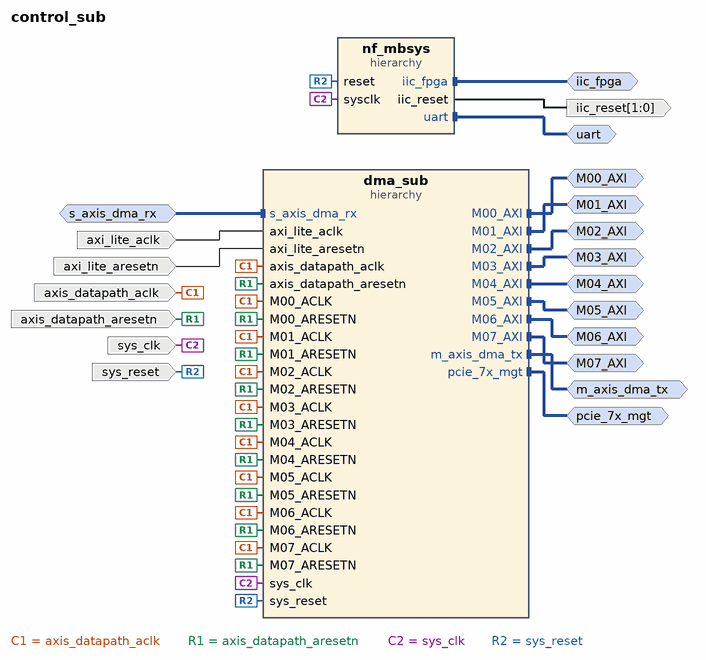
[diagram p0: block diagram of the top level]
# Vivado block design control_sub, xc7vx690tffg1761-3, Vivado 2016.4
create_bd_design control_sub

create_bd_intf_port -mode Master -vlnv xilinx.com:interface:aximm_rtl:1.0 M00_AXI
set_property -dict {CONFIG.DATA_WIDTH 32 CONFIG.PROTOCOL AXI4LITE CONFIG.ADDR_WIDTH 12} [get_bd_intf_ports M00_AXI]
create_bd_intf_port -mode Master -vlnv xilinx.com:interface:aximm_rtl:1.0 M01_AXI
set_property -dict {CONFIG.DATA_WIDTH 32 CONFIG.PROTOCOL AXI4LITE CONFIG.ADDR_WIDTH 12} [get_bd_intf_ports M01_AXI]
create_bd_intf_port -mode Master -vlnv xilinx.com:interface:aximm_rtl:1.0 M02_AXI
set_property -dict {CONFIG.DATA_WIDTH 32 CONFIG.PROTOCOL AXI4LITE CONFIG.ADDR_WIDTH 12} [get_bd_intf_ports M02_AXI]
create_bd_intf_port -mode Master -vlnv xilinx.com:interface:aximm_rtl:1.0 M03_AXI
set_property -dict {CONFIG.DATA_WIDTH 32 CONFIG.PROTOCOL AXI4LITE CONFIG.ADDR_WIDTH 12} [get_bd_intf_ports M03_AXI]
create_bd_intf_port -mode Master -vlnv xilinx.com:interface:aximm_rtl:1.0 M04_AXI
set_property -dict {CONFIG.DATA_WIDTH 32 CONFIG.PROTOCOL AXI4LITE CONFIG.ADDR_WIDTH 12} [get_bd_intf_ports M04_AXI]
create_bd_intf_port -mode Master -vlnv xilinx.com:interface:aximm_rtl:1.0 M05_AXI
set_property -dict {CONFIG.DATA_WIDTH 32 CONFIG.PROTOCOL AXI4LITE CONFIG.ADDR_WIDTH 12} [get_bd_intf_ports M05_AXI]
create_bd_intf_port -mode Master -vlnv xilinx.com:interface:aximm_rtl:1.0 M06_AXI
set_property -dict {CONFIG.DATA_WIDTH 32 CONFIG.PROTOCOL AXI4LITE CONFIG.ADDR_WIDTH 12} [get_bd_intf_ports M06_AXI]
create_bd_intf_port -mode Master -vlnv xilinx.com:interface:aximm_rtl:1.0 M07_AXI
set_property -dict {CONFIG.DATA_WIDTH 32 CONFIG.PROTOCOL AXI4LITE CONFIG.ADDR_WIDTH 12} [get_bd_intf_ports M07_AXI]
create_bd_intf_port -mode Master -vlnv xilinx.com:interface:iic_rtl:1.0 iic_fpga
create_bd_intf_port -mode Master -vlnv xilinx.com:interface:axis_rtl:1.0 m_axis_dma_tx
create_bd_intf_port -mode Master -vlnv xilinx.com:interface:pcie_7x_mgt_rtl:1.0 pcie_7x_mgt
create_bd_intf_port -mode Slave -vlnv xilinx.com:interface:axis_rtl:1.0 s_axis_dma_rx
set_property -dict [list \
  CONFIG.TDATA_NUM_BYTES 32 \
  CONFIG.TDEST_WIDTH 0 \
  CONFIG.TID_WIDTH 0 \
  CONFIG.TUSER_WIDTH 128 \
  CONFIG.HAS_TREADY 1 \
  CONFIG.HAS_TSTRB 0 \
  CONFIG.HAS_TKEEP 1 \
  CONFIG.HAS_TLAST 1 \
  CONFIG.FREQ_HZ 100000000 \
  CONFIG.PHASE 0.000 \
  CONFIG.LAYERED_METADATA undef \
] [get_bd_intf_ports s_axis_dma_rx]
create_bd_intf_port -mode Master -vlnv xilinx.com:interface:uart_rtl:1.0 uart
create_bd_port -dir I -type clk axi_lite_aclk
create_bd_port -dir I -type rst axi_lite_aresetn
set_property -dict {CONFIG.POLARITY ACTIVE_LOW} [get_bd_ports axi_lite_aresetn]
create_bd_port -dir I -type clk axis_datapath_aclk
create_bd_port -dir I -type rst axis_datapath_aresetn
set_property -dict {CONFIG.POLARITY ACTIVE_LOW} [get_bd_ports axis_datapath_aresetn]
create_bd_port -dir O -from 1 -to 0 iic_reset
create_bd_port -dir I -type clk sys_clk
set_property -dict {CONFIG.FREQ_HZ 100000000} [get_bd_ports sys_clk]
create_bd_port -dir I -type rst sys_reset
set_property -dict {CONFIG.POLARITY ACTIVE_HIGH} [get_bd_ports sys_reset]

create_bd_cell -type hier dma_sub
create_bd_cell -type hier nf_mbsys

# ---- hierarchy /dma_sub ----
current_bd_instance /dma_sub
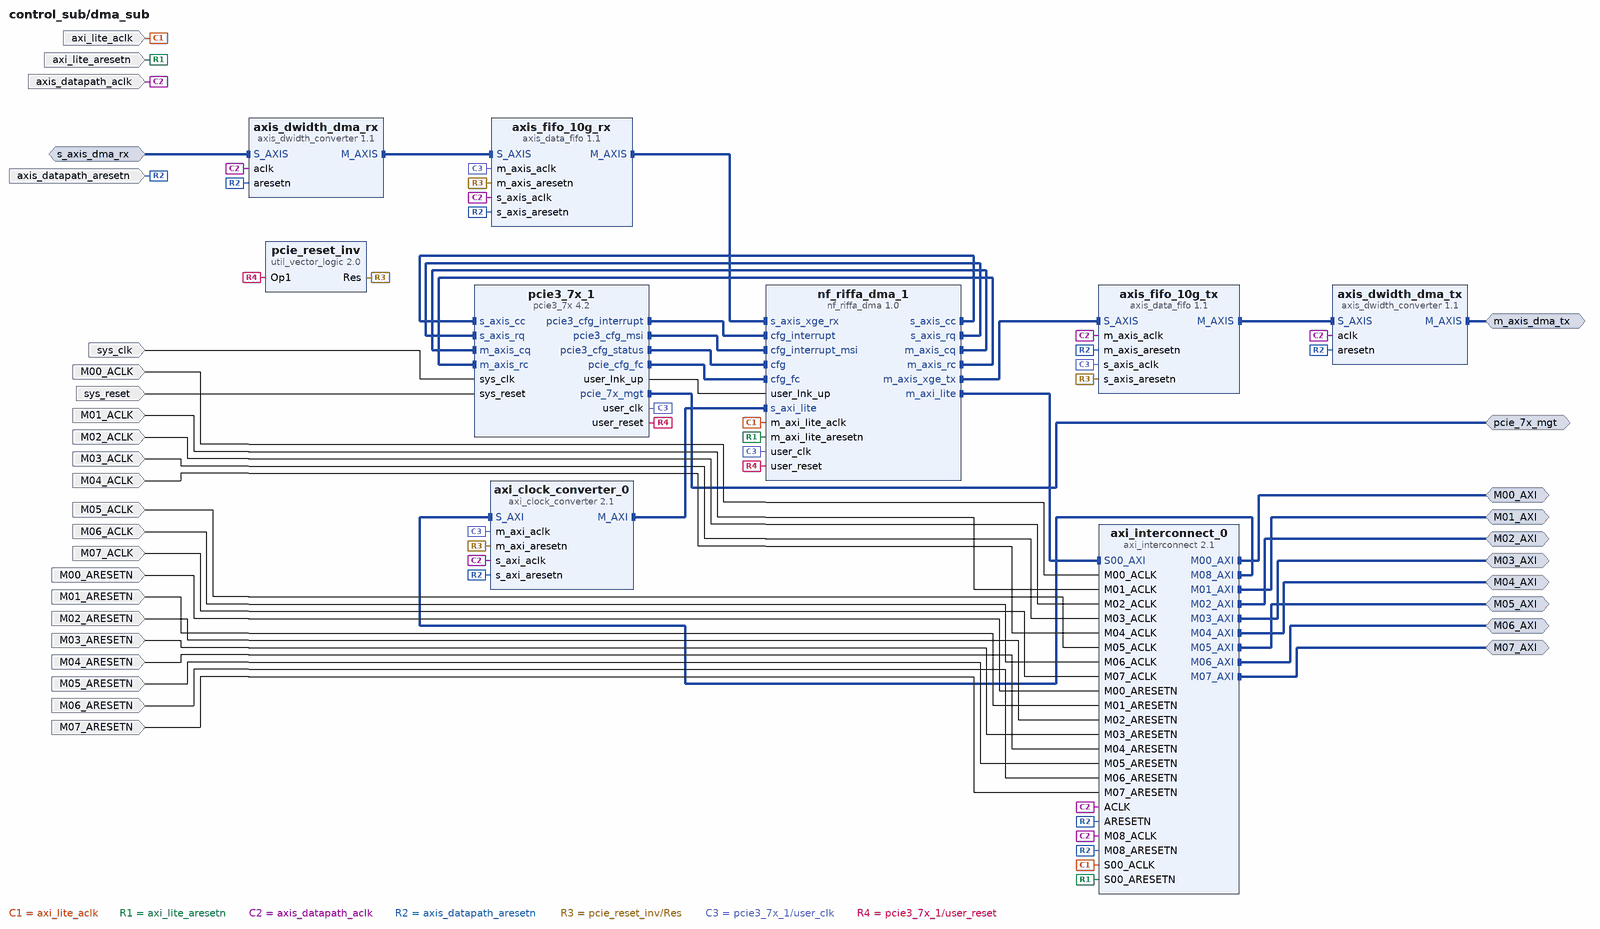
[diagram p1: block diagram inside /dma_sub]
create_bd_intf_pin -mode Master -vlnv xilinx.com:interface:aximm_rtl:1.0 M00_AXI
create_bd_intf_pin -mode Master -vlnv xilinx.com:interface:aximm_rtl:1.0 M01_AXI
create_bd_intf_pin -mode Master -vlnv xilinx.com:interface:aximm_rtl:1.0 M02_AXI
create_bd_intf_pin -mode Master -vlnv xilinx.com:interface:aximm_rtl:1.0 M03_AXI
create_bd_intf_pin -mode Master -vlnv xilinx.com:interface:aximm_rtl:1.0 M04_AXI
create_bd_intf_pin -mode Master -vlnv xilinx.com:interface:aximm_rtl:1.0 M05_AXI
create_bd_intf_pin -mode Master -vlnv xilinx.com:interface:aximm_rtl:1.0 M06_AXI
create_bd_intf_pin -mode Master -vlnv xilinx.com:interface:aximm_rtl:1.0 M07_AXI
create_bd_intf_pin -mode Master -vlnv xilinx.com:interface:axis_rtl:1.0 m_axis_dma_tx
create_bd_intf_pin -mode Master -vlnv xilinx.com:interface:pcie_7x_mgt_rtl:1.0 pcie_7x_mgt
create_bd_intf_pin -mode Slave -vlnv xilinx.com:interface:axis_rtl:1.0 s_axis_dma_rx
create_bd_pin -dir I -type clk axi_lite_aclk
create_bd_pin -dir I -type rst axi_lite_aresetn
create_bd_pin -dir I -type clk axis_datapath_aclk
create_bd_pin -dir I -type rst axis_datapath_aresetn
create_bd_pin -dir I -type clk sys_clk
create_bd_pin -dir I -type rst sys_reset
create_bd_pin -dir I -type clk M00_ACLK
create_bd_pin -dir I -type rst M00_ARESETN
create_bd_pin -dir I -type clk M01_ACLK
create_bd_pin -dir I -type rst M01_ARESETN
create_bd_pin -dir I -type clk M02_ACLK
create_bd_pin -dir I -type rst M02_ARESETN
create_bd_pin -dir I -type clk M03_ACLK
create_bd_pin -dir I -type rst M03_ARESETN
create_bd_pin -dir I -type clk M04_ACLK
create_bd_pin -dir I -type rst M04_ARESETN
create_bd_pin -dir I -type clk M05_ACLK
create_bd_pin -dir I -type rst M05_ARESETN
create_bd_pin -dir I -type clk M06_ACLK
create_bd_pin -dir I -type rst M06_ARESETN
create_bd_pin -dir I -type clk M07_ACLK
create_bd_pin -dir I -type rst M07_ARESETN

create_bd_cell -type ip -vlnv xilinx.com:ip:axi_interconnect:2.1 axi_interconnect_0
set_property -dict [list \
  CONFIG.NUM_MI 9 \
  CONFIG.M00_HAS_REGSLICE 3 \
  CONFIG.M01_HAS_REGSLICE 3 \
  CONFIG.M02_HAS_REGSLICE 3 \
  CONFIG.M03_HAS_REGSLICE 3 \
  CONFIG.M04_HAS_REGSLICE 3 \
  CONFIG.M05_HAS_REGSLICE 3 \
  CONFIG.M06_HAS_REGSLICE 3 \
  CONFIG.M07_HAS_REGSLICE 3 \
  CONFIG.M08_HAS_REGSLICE 3 \
  CONFIG.M00_HAS_DATA_FIFO 1 \
  CONFIG.M01_HAS_DATA_FIFO 1 \
  CONFIG.M02_HAS_DATA_FIFO 1 \
  CONFIG.M03_HAS_DATA_FIFO 1 \
  CONFIG.M04_HAS_DATA_FIFO 1 \
  CONFIG.M05_HAS_DATA_FIFO 1 \
  CONFIG.M06_HAS_DATA_FIFO 1 \
  CONFIG.M07_HAS_DATA_FIFO 1 \
  CONFIG.M08_HAS_DATA_FIFO 1 \
  CONFIG.S00_HAS_REGSLICE 3 \
  CONFIG.S00_HAS_DATA_FIFO 1 \
] [get_bd_cells axi_interconnect_0]
create_bd_cell -type ip -vlnv xilinx.com:ip:util_vector_logic:2.0 pcie_reset_inv
set_property -dict {CONFIG.C_SIZE 1 CONFIG.C_OPERATION not} [get_bd_cells pcie_reset_inv]
create_bd_cell -type ip -vlnv xilinx.com:ip:axis_dwidth_converter:1.1 axis_dwidth_dma_tx
set_property -dict [list \
  CONFIG.S_TDATA_NUM_BYTES 16 \
  CONFIG.M_TDATA_NUM_BYTES 32 \
  CONFIG.TUSER_BITS_PER_BYTE 8 \
  CONFIG.HAS_TLAST 1 \
  CONFIG.HAS_TSTRB 0 \
  CONFIG.HAS_TKEEP 1 \
  CONFIG.HAS_MI_TKEEP 1 \
] [get_bd_cells axis_dwidth_dma_tx]
create_bd_cell -type ip -vlnv xilinx.com:ip:axis_dwidth_converter:1.1 axis_dwidth_dma_rx
set_property -dict [list \
  CONFIG.S_TDATA_NUM_BYTES 32 \
  CONFIG.M_TDATA_NUM_BYTES 16 \
  CONFIG.TUSER_BITS_PER_BYTE 8 \
  CONFIG.HAS_TLAST 1 \
  CONFIG.HAS_TSTRB 0 \
  CONFIG.HAS_TKEEP 1 \
  CONFIG.HAS_MI_TKEEP 1 \
] [get_bd_cells axis_dwidth_dma_rx]
create_bd_cell -type ip -vlnv xilinx.com:ip:axis_data_fifo:1.1 axis_fifo_10g_rx
set_property -dict [list \
  CONFIG.TDATA_NUM_BYTES 16 \
  CONFIG.TUSER_WIDTH 128 \
  CONFIG.FIFO_DEPTH 32 \
  CONFIG.IS_ACLK_ASYNC 1 \
] [get_bd_cells axis_fifo_10g_rx]
create_bd_cell -type ip -vlnv xilinx.com:ip:axis_data_fifo:1.1 axis_fifo_10g_tx
set_property -dict [list \
  CONFIG.TDATA_NUM_BYTES 16 \
  CONFIG.TUSER_WIDTH 128 \
  CONFIG.FIFO_DEPTH 32 \
  CONFIG.IS_ACLK_ASYNC 1 \
] [get_bd_cells axis_fifo_10g_tx]
create_bd_cell -type ip -vlnv NetFPGA:NetFPGA:nf_riffa_dma:1.0 nf_riffa_dma_1
create_bd_cell -type ip -vlnv xilinx.com:ip:axi_clock_converter:2.1 axi_clock_converter_0
create_bd_cell -type ip -vlnv xilinx.com:ip:pcie3_7x:4.2 pcie3_7x_1
set_property -dict [list \
  CONFIG.xlnx_ref_board None \
  CONFIG.PL_LINK_CAP_MAX_LINK_SPEED 5.0_GT/s \
  CONFIG.PL_LINK_CAP_MAX_LINK_WIDTH X8 \
  CONFIG.axisten_if_enable_client_tag false \
  CONFIG.PF0_DEVICE_ID 7028 \
  CONFIG.PF0_INTERRUPT_PIN NONE \
  CONFIG.PF1_DEVICE_ID 7011 \
  CONFIG.pcie_blk_locn X0Y1 \
  CONFIG.pf0_bar0_size 1 \
  CONFIG.pf0_dev_cap_max_payload 128_bytes \
  CONFIG.gen_x0y0 false \
  CONFIG.extended_tag_field true \
  CONFIG.axisten_if_width 128_bit \
  CONFIG.mode_selection Advanced \
  CONFIG.en_ext_clk false \
  CONFIG.tx_fc_if false \
  CONFIG.cfg_ext_if false \
  CONFIG.per_func_status_if false \
  CONFIG.cfg_mgmt_if false \
  CONFIG.rcv_msg_if false \
  CONFIG.cfg_tx_msg_if false \
  CONFIG.cfg_ctl_if false \
  CONFIG.axisten_freq 250 \
] [get_bd_cells pcie3_7x_1]

# ---- hierarchy /nf_mbsys ----
current_bd_instance /nf_mbsys
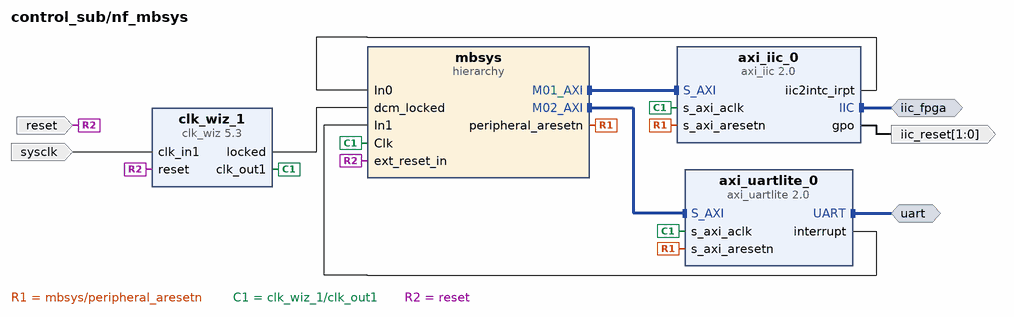
[diagram p2: block diagram inside /nf_mbsys]
create_bd_intf_pin -mode Master -vlnv xilinx.com:interface:iic_rtl:1.0 iic_fpga
create_bd_intf_pin -mode Master -vlnv xilinx.com:interface:uart_rtl:1.0 uart
create_bd_pin -dir O -from 1 -to 0 iic_reset
create_bd_pin -dir I -type rst reset
create_bd_pin -dir I -type clk sysclk

create_bd_cell -type ip -vlnv xilinx.com:ip:axi_iic:2.0 axi_iic_0
set_property -dict {CONFIG.C_GPO_WIDTH 2 CONFIG.C_SCL_INERTIAL_DELAY 5 CONFIG.C_SDA_INERTIAL_DELAY 5} [get_bd_cells axi_iic_0]
create_bd_cell -type ip -vlnv xilinx.com:ip:axi_uartlite:2.0 axi_uartlite_0
set_property -dict {CONFIG.C_BAUDRATE 115200} [get_bd_cells axi_uartlite_0]
create_bd_cell -type ip -vlnv xilinx.com:ip:clk_wiz:5.3 clk_wiz_1
set_property -dict [list \
  CONFIG.PRIM_IN_FREQ 100.000 \
  CONFIG.CLKIN1_JITTER_PS 100.0 \
  CONFIG.PRIM_SOURCE No_buffer \
  CONFIG.MMCM_CLKFBOUT_MULT_F 10.000 \
  CONFIG.MMCM_CLKIN1_PERIOD 10.0 \
  CONFIG.CLKOUT1_JITTER 130.958 \
  CONFIG.CLKOUT1_PHASE_ERROR 98.575 \
] [get_bd_cells clk_wiz_1]
create_bd_cell -type hier mbsys

# ---- hierarchy /nf_mbsys/mbsys ----
current_bd_instance /nf_mbsys/mbsys
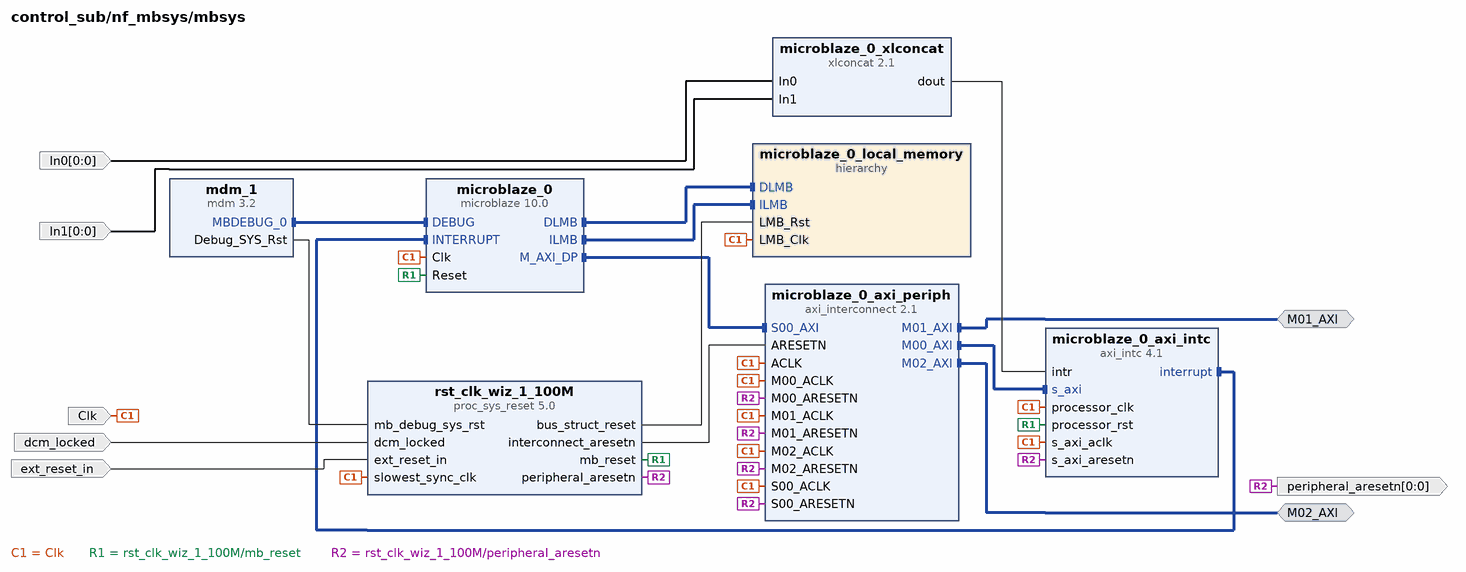
[diagram p3: block diagram inside /nf_mbsys/mbsys]
create_bd_intf_pin -mode Master -vlnv xilinx.com:interface:aximm_rtl:1.0 M01_AXI
create_bd_intf_pin -mode Master -vlnv xilinx.com:interface:aximm_rtl:1.0 M02_AXI
create_bd_pin -dir I -type clk Clk
create_bd_pin -dir I -from 0 -to 0 In0
create_bd_pin -dir I -from 0 -to 0 In1
create_bd_pin -dir I dcm_locked
create_bd_pin -dir I -type rst ext_reset_in
create_bd_pin -dir O -from 0 -to 0 -type rst peripheral_aresetn

create_bd_cell -type ip -vlnv xilinx.com:ip:mdm:3.2 mdm_1
create_bd_cell -type ip -vlnv xilinx.com:ip:microblaze:10.0 microblaze_0
set_property -dict {CONFIG.C_D_AXI 1 CONFIG.C_D_LMB 1 CONFIG.C_I_LMB 1 CONFIG.C_DEBUG_ENABLED 1} [get_bd_cells microblaze_0]
create_bd_cell -type ip -vlnv xilinx.com:ip:axi_intc:4.1 microblaze_0_axi_intc
set_property -dict {CONFIG.C_HAS_FAST 1} [get_bd_cells microblaze_0_axi_intc]
create_bd_cell -type ip -vlnv xilinx.com:ip:axi_interconnect:2.1 microblaze_0_axi_periph
set_property -dict {CONFIG.NUM_MI 3} [get_bd_cells microblaze_0_axi_periph]
create_bd_cell -type hier microblaze_0_local_memory
create_bd_cell -type ip -vlnv xilinx.com:ip:xlconcat:2.1 microblaze_0_xlconcat
create_bd_cell -type ip -vlnv xilinx.com:ip:proc_sys_reset:5.0 rst_clk_wiz_1_100M

# ---- hierarchy /nf_mbsys/mbsys/microblaze_0_local_memory ----
current_bd_instance /nf_mbsys/mbsys/microblaze_0_local_memory
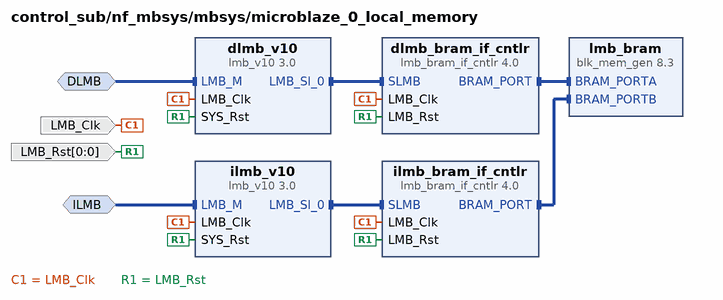
[diagram p4: block diagram inside /nf_mbsys/mbsys/microblaze_0_local_memory]
create_bd_intf_pin -mode MirroredMaster -vlnv xilinx.com:interface:lmb_rtl:1.0 DLMB
create_bd_intf_pin -mode MirroredMaster -vlnv xilinx.com:interface:lmb_rtl:1.0 ILMB
create_bd_pin -dir I -type clk LMB_Clk
create_bd_pin -dir I -from 0 -to 0 -type rst LMB_Rst

create_bd_cell -type ip -vlnv xilinx.com:ip:lmb_bram_if_cntlr:4.0 dlmb_bram_if_cntlr
set_property -dict {CONFIG.C_ECC 0} [get_bd_cells dlmb_bram_if_cntlr]
create_bd_cell -type ip -vlnv xilinx.com:ip:lmb_v10:3.0 dlmb_v10
create_bd_cell -type ip -vlnv xilinx.com:ip:lmb_bram_if_cntlr:4.0 ilmb_bram_if_cntlr
set_property -dict {CONFIG.C_ECC 0} [get_bd_cells ilmb_bram_if_cntlr]
create_bd_cell -type ip -vlnv xilinx.com:ip:lmb_v10:3.0 ilmb_v10
create_bd_cell -type ip -vlnv xilinx.com:ip:blk_mem_gen:8.3 lmb_bram
set_property -dict {CONFIG.Memory_Type True_Dual_Port_RAM CONFIG.use_bram_block BRAM_Controller} [get_bd_cells lmb_bram]

# ---- connections ----

current_bd_instance /dma_sub
connect_bd_intf_net -intf_net nf_riffa_dma_1_fifo_dwidth_rx [get_bd_intf_pins axis_fifo_10g_rx/S_AXIS] [get_bd_intf_pins axis_dwidth_dma_rx/M_AXIS]
connect_bd_intf_net [get_bd_intf_pins axis_fifo_10g_rx/M_AXIS] [get_bd_intf_pins nf_riffa_dma_1/s_axis_xge_rx]
connect_bd_intf_net -intf_net nf_riffa_dma_1_fifo_dwidth_tx [get_bd_intf_pins axis_fifo_10g_tx/M_AXIS] [get_bd_intf_pins axis_dwidth_dma_tx/S_AXIS]
connect_bd_intf_net -intf_net nf_riffa_dma_1_dwidth_conv_tx [get_bd_intf_pins axis_fifo_10g_tx/S_AXIS] [get_bd_intf_pins nf_riffa_dma_1/m_axis_xge_tx]
connect_bd_intf_net -intf_net nf_riffa_dma_1_pcie3_cfg_interrupt [get_bd_intf_pins nf_riffa_dma_1/cfg_interrupt] [get_bd_intf_pins pcie3_7x_1/pcie3_cfg_interrupt]
connect_bd_intf_net -intf_net nf_riffa_dma_1_pcie3_cfg_msi [get_bd_intf_pins nf_riffa_dma_1/cfg_interrupt_msi] [get_bd_intf_pins pcie3_7x_1/pcie3_cfg_msi]
connect_bd_intf_net -intf_net nf_riffa_dma_1_pcie3_cfg_status [get_bd_intf_pins nf_riffa_dma_1/cfg] [get_bd_intf_pins pcie3_7x_1/pcie3_cfg_status]
connect_bd_intf_net -intf_net nf_riffa_dma_1_pcie_cfg_fc [get_bd_intf_pins nf_riffa_dma_1/cfg_fc] [get_bd_intf_pins pcie3_7x_1/pcie_cfg_fc]
connect_bd_intf_net [get_bd_intf_pins nf_riffa_dma_1/s_axis_cc] [get_bd_intf_pins pcie3_7x_1/s_axis_cc]
connect_bd_intf_net [get_bd_intf_pins nf_riffa_dma_1/s_axis_rq] [get_bd_intf_pins pcie3_7x_1/s_axis_rq]
connect_bd_intf_net [get_bd_intf_pins nf_riffa_dma_1/m_axis_cq] [get_bd_intf_pins pcie3_7x_1/m_axis_cq]
connect_bd_intf_net [get_bd_intf_pins nf_riffa_dma_1/m_axis_rc] [get_bd_intf_pins pcie3_7x_1/m_axis_rc]
connect_bd_intf_net [get_bd_intf_pins axi_interconnect_0/S00_AXI] [get_bd_intf_pins nf_riffa_dma_1/m_axi_lite]
connect_bd_intf_net [get_bd_intf_pins axi_clock_converter_0/M_AXI] [get_bd_intf_pins nf_riffa_dma_1/s_axi_lite]
connect_bd_intf_net [get_bd_intf_pins axi_clock_converter_0/S_AXI] [get_bd_intf_pins axi_interconnect_0/M08_AXI]
connect_bd_intf_net [get_bd_intf_pins M00_AXI] [get_bd_intf_pins axi_interconnect_0/M00_AXI]
connect_bd_intf_net [get_bd_intf_pins M01_AXI] [get_bd_intf_pins axi_interconnect_0/M01_AXI]
connect_bd_intf_net [get_bd_intf_pins M02_AXI] [get_bd_intf_pins axi_interconnect_0/M02_AXI]
connect_bd_intf_net [get_bd_intf_pins M03_AXI] [get_bd_intf_pins axi_interconnect_0/M03_AXI]
connect_bd_intf_net [get_bd_intf_pins M04_AXI] [get_bd_intf_pins axi_interconnect_0/M04_AXI]
connect_bd_intf_net [get_bd_intf_pins M05_AXI] [get_bd_intf_pins axi_interconnect_0/M05_AXI]
connect_bd_intf_net [get_bd_intf_pins M06_AXI] [get_bd_intf_pins axi_interconnect_0/M06_AXI]
connect_bd_intf_net [get_bd_intf_pins M07_AXI] [get_bd_intf_pins axi_interconnect_0/M07_AXI]
connect_bd_intf_net -intf_net nf_riffa_dma_1_m_axis_dma_tx [get_bd_intf_pins m_axis_dma_tx] [get_bd_intf_pins axis_dwidth_dma_tx/M_AXIS]
connect_bd_intf_net [get_bd_intf_pins pcie_7x_mgt] [get_bd_intf_pins pcie3_7x_1/pcie_7x_mgt]
connect_bd_intf_net -intf_net nf_riffa_dma_1_s_axis_dma_rx [get_bd_intf_pins s_axis_dma_rx] [get_bd_intf_pins axis_dwidth_dma_rx/S_AXIS]
connect_bd_net -net axi_lite_clk_1 [get_bd_pins axi_lite_aclk] [get_bd_pins axi_interconnect_0/S00_ACLK] [get_bd_pins nf_riffa_dma_1/m_axi_lite_aclk]
connect_bd_net -net M00_ACLK_i [get_bd_pins M00_ACLK] [get_bd_pins axi_interconnect_0/M00_ACLK]
connect_bd_net -net M01_ACLK_i [get_bd_pins M01_ACLK] [get_bd_pins axi_interconnect_0/M01_ACLK]
connect_bd_net -net M02_ACLK_i [get_bd_pins M02_ACLK] [get_bd_pins axi_interconnect_0/M02_ACLK]
connect_bd_net -net M03_ACLK_i [get_bd_pins M03_ACLK] [get_bd_pins axi_interconnect_0/M03_ACLK]
connect_bd_net -net M04_ACLK_i [get_bd_pins M04_ACLK] [get_bd_pins axi_interconnect_0/M04_ACLK]
connect_bd_net -net M05_ACLK_i [get_bd_pins M05_ACLK] [get_bd_pins axi_interconnect_0/M05_ACLK]
connect_bd_net -net M06_ACLK_i [get_bd_pins M06_ACLK] [get_bd_pins axi_interconnect_0/M06_ACLK]
connect_bd_net -net M07_ACLK_i [get_bd_pins M07_ACLK] [get_bd_pins axi_interconnect_0/M07_ACLK]
connect_bd_net -net axi_lite_rstn_1 [get_bd_pins axi_lite_aresetn] \
  [get_bd_pins axi_interconnect_0/S00_ARESETN] [get_bd_pins nf_riffa_dma_1/m_axi_lite_aresetn]
connect_bd_net -net M00_ARESETN_i [get_bd_pins M00_ARESETN] [get_bd_pins axi_interconnect_0/M00_ARESETN]
connect_bd_net -net M01_ARESETN_i [get_bd_pins M01_ARESETN] [get_bd_pins axi_interconnect_0/M01_ARESETN]
connect_bd_net -net M02_ARESETN_i [get_bd_pins M02_ARESETN] [get_bd_pins axi_interconnect_0/M02_ARESETN]
connect_bd_net -net M03_ARESETN_i [get_bd_pins M03_ARESETN] [get_bd_pins axi_interconnect_0/M03_ARESETN]
connect_bd_net -net M04_ARESETN_i [get_bd_pins M04_ARESETN] [get_bd_pins axi_interconnect_0/M04_ARESETN]
connect_bd_net -net M05_ARESETN_i [get_bd_pins M05_ARESETN] [get_bd_pins axi_interconnect_0/M05_ARESETN]
connect_bd_net -net M06_ARESETN_i [get_bd_pins M06_ARESETN] [get_bd_pins axi_interconnect_0/M06_ARESETN]
connect_bd_net -net M07_ARESETN_i [get_bd_pins M07_ARESETN] [get_bd_pins axi_interconnect_0/M07_ARESETN]
connect_bd_net -net axis_10g_clk_1 [get_bd_pins axis_datapath_aclk] \
  [get_bd_pins axi_clock_converter_0/s_axi_aclk] [get_bd_pins axi_interconnect_0/ACLK] \
  [get_bd_pins axi_interconnect_0/M08_ACLK] [get_bd_pins axis_dwidth_dma_rx/aclk] [get_bd_pins axis_dwidth_dma_tx/aclk] \
  [get_bd_pins axis_fifo_10g_rx/s_axis_aclk] [get_bd_pins axis_fifo_10g_tx/m_axis_aclk]
connect_bd_net -net axis_rx_sys_reset_0_peripheral_aresetn [get_bd_pins axis_datapath_aresetn] \
  [get_bd_pins axi_clock_converter_0/s_axi_aresetn] [get_bd_pins axi_interconnect_0/ARESETN] \
  [get_bd_pins axi_interconnect_0/M08_ARESETN] [get_bd_pins axis_dwidth_dma_rx/aresetn] \
  [get_bd_pins axis_dwidth_dma_tx/aresetn] [get_bd_pins axis_fifo_10g_rx/s_axis_aresetn] \
  [get_bd_pins axis_fifo_10g_tx/m_axis_aresetn]
connect_bd_net -net axis_tx_sys_reset_0_peripheral_aresetn [get_bd_pins pcie_reset_inv/Res] \
  [get_bd_pins axi_clock_converter_0/m_axi_aresetn] [get_bd_pins axis_fifo_10g_rx/m_axis_aresetn] \
  [get_bd_pins axis_fifo_10g_tx/s_axis_aresetn]
connect_bd_net [get_bd_pins pcie3_7x_1/user_clk] \
  [get_bd_pins axi_clock_converter_0/m_axi_aclk] [get_bd_pins axis_fifo_10g_rx/m_axis_aclk] \
  [get_bd_pins axis_fifo_10g_tx/s_axis_aclk] [get_bd_pins nf_riffa_dma_1/user_clk]
connect_bd_net [get_bd_pins pcie3_7x_1/user_lnk_up] [get_bd_pins nf_riffa_dma_1/user_lnk_up]
connect_bd_net [get_bd_pins pcie3_7x_1/user_reset] [get_bd_pins pcie_reset_inv/Op1] [get_bd_pins nf_riffa_dma_1/user_reset]
connect_bd_net [get_bd_pins sys_clk] [get_bd_pins pcie3_7x_1/sys_clk]
connect_bd_net [get_bd_pins sys_reset] [get_bd_pins pcie3_7x_1/sys_reset]

current_bd_instance /nf_mbsys
connect_bd_intf_net [get_bd_intf_pins axi_iic_0/S_AXI] [get_bd_intf_pins mbsys/M01_AXI]
connect_bd_intf_net [get_bd_intf_pins axi_uartlite_0/S_AXI] [get_bd_intf_pins mbsys/M02_AXI]
connect_bd_intf_net [get_bd_intf_pins iic_fpga] [get_bd_intf_pins axi_iic_0/IIC]
connect_bd_intf_net [get_bd_intf_pins uart] [get_bd_intf_pins axi_uartlite_0/UART]
connect_bd_net [get_bd_pins axi_iic_0/gpo] [get_bd_pins iic_reset]
connect_bd_net [get_bd_pins axi_iic_0/iic2intc_irpt] [get_bd_pins mbsys/In0]
connect_bd_net [get_bd_pins axi_uartlite_0/interrupt] [get_bd_pins mbsys/In1]
connect_bd_net [get_bd_pins clk_wiz_1/locked] [get_bd_pins mbsys/dcm_locked]
connect_bd_net [get_bd_pins mbsys/peripheral_aresetn] [get_bd_pins axi_iic_0/s_axi_aresetn] [get_bd_pins axi_uartlite_0/s_axi_aresetn]
connect_bd_net -net microblaze_0_Clk [get_bd_pins clk_wiz_1/clk_out1] \
  [get_bd_pins axi_iic_0/s_axi_aclk] [get_bd_pins axi_uartlite_0/s_axi_aclk] [get_bd_pins mbsys/Clk]
connect_bd_net [get_bd_pins reset] [get_bd_pins clk_wiz_1/reset] [get_bd_pins mbsys/ext_reset_in]
connect_bd_net [get_bd_pins sysclk] [get_bd_pins clk_wiz_1/clk_in1]

current_bd_instance /nf_mbsys/mbsys
connect_bd_intf_net -intf_net microblaze_0_axi_dp [get_bd_intf_pins microblaze_0/M_AXI_DP] [get_bd_intf_pins microblaze_0_axi_periph/S00_AXI]
connect_bd_intf_net [get_bd_intf_pins mdm_1/MBDEBUG_0] [get_bd_intf_pins microblaze_0/DEBUG]
connect_bd_intf_net [get_bd_intf_pins microblaze_0/DLMB] [get_bd_intf_pins microblaze_0_local_memory/DLMB]
connect_bd_intf_net [get_bd_intf_pins microblaze_0/ILMB] [get_bd_intf_pins microblaze_0_local_memory/ILMB]
connect_bd_intf_net -intf_net microblaze_0_intc_axi [get_bd_intf_pins microblaze_0_axi_intc/s_axi] [get_bd_intf_pins microblaze_0_axi_periph/M00_AXI]
connect_bd_intf_net [get_bd_intf_pins microblaze_0/INTERRUPT] [get_bd_intf_pins microblaze_0_axi_intc/interrupt]
connect_bd_intf_net [get_bd_intf_pins M01_AXI] [get_bd_intf_pins microblaze_0_axi_periph/M01_AXI]
connect_bd_intf_net [get_bd_intf_pins M02_AXI] [get_bd_intf_pins microblaze_0_axi_periph/M02_AXI]
connect_bd_net -net In0_1 [get_bd_pins In0] [get_bd_pins microblaze_0_xlconcat/In0]
connect_bd_net -net In1_1 [get_bd_pins In1] [get_bd_pins microblaze_0_xlconcat/In1]
connect_bd_net -net clk_wiz_1_locked [get_bd_pins dcm_locked] [get_bd_pins rst_clk_wiz_1_100M/dcm_locked]
connect_bd_net [get_bd_pins mdm_1/Debug_SYS_Rst] [get_bd_pins rst_clk_wiz_1_100M/mb_debug_sys_rst]
connect_bd_net -net microblaze_0_Clk [get_bd_pins Clk] \
  [get_bd_pins microblaze_0/Clk] [get_bd_pins microblaze_0_axi_intc/processor_clk] \
  [get_bd_pins microblaze_0_axi_intc/s_axi_aclk] [get_bd_pins microblaze_0_axi_periph/ACLK] \
  [get_bd_pins microblaze_0_axi_periph/M00_ACLK] [get_bd_pins microblaze_0_axi_periph/M01_ACLK] \
  [get_bd_pins microblaze_0_axi_periph/M02_ACLK] [get_bd_pins microblaze_0_axi_periph/S00_ACLK] \
  [get_bd_pins microblaze_0_local_memory/LMB_Clk] [get_bd_pins rst_clk_wiz_1_100M/slowest_sync_clk]
connect_bd_net -net microblaze_0_intr [get_bd_pins microblaze_0_xlconcat/dout] [get_bd_pins microblaze_0_axi_intc/intr]
connect_bd_net -net reset_1 [get_bd_pins ext_reset_in] [get_bd_pins rst_clk_wiz_1_100M/ext_reset_in]
connect_bd_net [get_bd_pins rst_clk_wiz_1_100M/bus_struct_reset] [get_bd_pins microblaze_0_local_memory/LMB_Rst]
connect_bd_net [get_bd_pins rst_clk_wiz_1_100M/interconnect_aresetn] [get_bd_pins microblaze_0_axi_periph/ARESETN]
connect_bd_net [get_bd_pins rst_clk_wiz_1_100M/mb_reset] [get_bd_pins microblaze_0/Reset] [get_bd_pins microblaze_0_axi_intc/processor_rst]
connect_bd_net [get_bd_pins rst_clk_wiz_1_100M/peripheral_aresetn] \
  [get_bd_pins peripheral_aresetn] [get_bd_pins microblaze_0_axi_intc/s_axi_aresetn] \
  [get_bd_pins microblaze_0_axi_periph/M00_ARESETN] [get_bd_pins microblaze_0_axi_periph/M01_ARESETN] \
  [get_bd_pins microblaze_0_axi_periph/M02_ARESETN] [get_bd_pins microblaze_0_axi_periph/S00_ARESETN]

current_bd_instance /nf_mbsys/mbsys/microblaze_0_local_memory
connect_bd_intf_net -intf_net microblaze_0_dlmb_bus [get_bd_intf_pins dlmb_bram_if_cntlr/SLMB] [get_bd_intf_pins dlmb_v10/LMB_Sl_0]
connect_bd_intf_net -intf_net microblaze_0_dlmb_cntlr [get_bd_intf_pins dlmb_bram_if_cntlr/BRAM_PORT] [get_bd_intf_pins lmb_bram/BRAM_PORTA]
connect_bd_intf_net -intf_net microblaze_0_ilmb_bus [get_bd_intf_pins ilmb_bram_if_cntlr/SLMB] [get_bd_intf_pins ilmb_v10/LMB_Sl_0]
connect_bd_intf_net -intf_net microblaze_0_ilmb_cntlr [get_bd_intf_pins ilmb_bram_if_cntlr/BRAM_PORT] [get_bd_intf_pins lmb_bram/BRAM_PORTB]
connect_bd_intf_net -intf_net microblaze_0_dlmb [get_bd_intf_pins DLMB] [get_bd_intf_pins dlmb_v10/LMB_M]
connect_bd_intf_net -intf_net microblaze_0_ilmb [get_bd_intf_pins ILMB] [get_bd_intf_pins ilmb_v10/LMB_M]
connect_bd_net -net microblaze_0_Clk [get_bd_pins LMB_Clk] \
  [get_bd_pins dlmb_bram_if_cntlr/LMB_Clk] [get_bd_pins dlmb_v10/LMB_Clk] [get_bd_pins ilmb_bram_if_cntlr/LMB_Clk] \
  [get_bd_pins ilmb_v10/LMB_Clk]
connect_bd_net -net microblaze_0_LMB_Rst [get_bd_pins LMB_Rst] \
  [get_bd_pins dlmb_bram_if_cntlr/LMB_Rst] [get_bd_pins dlmb_v10/SYS_Rst] [get_bd_pins ilmb_bram_if_cntlr/LMB_Rst] \
  [get_bd_pins ilmb_v10/SYS_Rst]

current_bd_instance /
connect_bd_intf_net [get_bd_intf_ports M00_AXI] [get_bd_intf_pins dma_sub/M00_AXI]
connect_bd_intf_net [get_bd_intf_ports M01_AXI] [get_bd_intf_pins dma_sub/M01_AXI]
connect_bd_intf_net [get_bd_intf_ports M02_AXI] [get_bd_intf_pins dma_sub/M02_AXI]
connect_bd_intf_net [get_bd_intf_ports M03_AXI] [get_bd_intf_pins dma_sub/M03_AXI]
connect_bd_intf_net [get_bd_intf_ports M04_AXI] [get_bd_intf_pins dma_sub/M04_AXI]
connect_bd_intf_net [get_bd_intf_ports M05_AXI] [get_bd_intf_pins dma_sub/M05_AXI]
connect_bd_intf_net [get_bd_intf_ports M06_AXI] [get_bd_intf_pins dma_sub/M06_AXI]
connect_bd_intf_net [get_bd_intf_ports M07_AXI] [get_bd_intf_pins dma_sub/M07_AXI]
connect_bd_intf_net [get_bd_intf_ports iic_fpga] [get_bd_intf_pins nf_mbsys/iic_fpga]
connect_bd_intf_net [get_bd_intf_ports m_axis_dma_tx] [get_bd_intf_pins dma_sub/m_axis_dma_tx]
connect_bd_intf_net [get_bd_intf_ports pcie_7x_mgt] [get_bd_intf_pins dma_sub/pcie_7x_mgt]
connect_bd_intf_net [get_bd_intf_ports s_axis_dma_rx] [get_bd_intf_pins dma_sub/s_axis_dma_rx]
connect_bd_intf_net [get_bd_intf_ports uart] [get_bd_intf_pins nf_mbsys/uart]
connect_bd_net [get_bd_ports axi_lite_aclk] [get_bd_pins dma_sub/axi_lite_aclk]
connect_bd_net [get_bd_ports axi_lite_aresetn] [get_bd_pins dma_sub/axi_lite_aresetn]
connect_bd_net [get_bd_ports axis_datapath_aclk] \
  [get_bd_pins dma_sub/axis_datapath_aclk] [get_bd_pins dma_sub/M00_ACLK] [get_bd_pins dma_sub/M01_ACLK] \
  [get_bd_pins dma_sub/M02_ACLK] [get_bd_pins dma_sub/M03_ACLK] [get_bd_pins dma_sub/M04_ACLK] [get_bd_pins dma_sub/M05_ACLK] \
  [get_bd_pins dma_sub/M06_ACLK] [get_bd_pins dma_sub/M07_ACLK]
connect_bd_net [get_bd_ports axis_datapath_aresetn] \
  [get_bd_pins dma_sub/axis_datapath_aresetn] [get_bd_pins dma_sub/M00_ARESETN] [get_bd_pins dma_sub/M01_ARESETN] \
  [get_bd_pins dma_sub/M02_ARESETN] [get_bd_pins dma_sub/M03_ARESETN] [get_bd_pins dma_sub/M04_ARESETN] \
  [get_bd_pins dma_sub/M05_ARESETN] [get_bd_pins dma_sub/M06_ARESETN] [get_bd_pins dma_sub/M07_ARESETN]
connect_bd_net [get_bd_pins nf_mbsys/iic_reset] [get_bd_ports iic_reset]
connect_bd_net [get_bd_ports sys_clk] [get_bd_pins dma_sub/sys_clk] [get_bd_pins nf_mbsys/sysclk]
connect_bd_net [get_bd_ports sys_reset] [get_bd_pins dma_sub/sys_reset] [get_bd_pins nf_mbsys/reset]

# ---- address map ----
assign_bd_address -offset 0x44000000 -range 4K -target_address_space [get_bd_addr_spaces dma_sub/nf_riffa_dma_1/m_axi_lite] [get_bd_addr_segs M00_AXI/Reg]
assign_bd_address -offset 0x44010000 -range 4K -target_address_space [get_bd_addr_spaces dma_sub/nf_riffa_dma_1/m_axi_lite] [get_bd_addr_segs M01_AXI/Reg]
assign_bd_address -offset 0x44020000 -range 4K -target_address_space [get_bd_addr_spaces dma_sub/nf_riffa_dma_1/m_axi_lite] [get_bd_addr_segs M02_AXI/Reg]
assign_bd_address -offset 0x44030000 -range 4K -target_address_space [get_bd_addr_spaces dma_sub/nf_riffa_dma_1/m_axi_lite] [get_bd_addr_segs M03_AXI/Reg]
assign_bd_address -offset 0x44040000 -range 4K -target_address_space [get_bd_addr_spaces dma_sub/nf_riffa_dma_1/m_axi_lite] [get_bd_addr_segs M04_AXI/Reg]
assign_bd_address -offset 0x44050000 -range 4K -target_address_space [get_bd_addr_spaces dma_sub/nf_riffa_dma_1/m_axi_lite] [get_bd_addr_segs M05_AXI/Reg]
assign_bd_address -offset 0x44060000 -range 4K -target_address_space [get_bd_addr_spaces dma_sub/nf_riffa_dma_1/m_axi_lite] [get_bd_addr_segs M06_AXI/Reg]
assign_bd_address -offset 0x44070000 -range 4K -target_address_space [get_bd_addr_spaces dma_sub/nf_riffa_dma_1/m_axi_lite] [get_bd_addr_segs M07_AXI/Reg]
assign_bd_address -offset 0x44080000 -range 4K -target_address_space [get_bd_addr_spaces dma_sub/nf_riffa_dma_1/m_axi_lite] [get_bd_addr_segs dma_sub/nf_riffa_dma_1/s_axi_lite/reg0]
assign_bd_address -offset 0x00000000 -range 64K -target_address_space [get_bd_addr_spaces nf_mbsys/mbsys/microblaze_0/Data] [get_bd_addr_segs nf_mbsys/mbsys/microblaze_0_local_memory/dlmb_bram_if_cntlr/SLMB/Mem]
assign_bd_address -offset 0x40600000 -range 64K -target_address_space [get_bd_addr_spaces nf_mbsys/mbsys/microblaze_0/Data] [get_bd_addr_segs nf_mbsys/axi_uartlite_0/S_AXI/Reg]
assign_bd_address -offset 0x40800000 -range 64K -target_address_space [get_bd_addr_spaces nf_mbsys/mbsys/microblaze_0/Data] [get_bd_addr_segs nf_mbsys/axi_iic_0/S_AXI/Reg]
assign_bd_address -offset 0x41200000 -range 64K -target_address_space [get_bd_addr_spaces nf_mbsys/mbsys/microblaze_0/Data] [get_bd_addr_segs nf_mbsys/mbsys/microblaze_0_axi_intc/S_AXI/Reg]
assign_bd_address -offset 0x00000000 -range 64K -target_address_space [get_bd_addr_spaces nf_mbsys/mbsys/microblaze_0/Instruction] [get_bd_addr_segs nf_mbsys/mbsys/microblaze_0_local_memory/ilmb_bram_if_cntlr/SLMB/Mem]

validate_bd_design
save_bd_design
